# Altium schematic sheet Микроконтроллер.SchDoc
size 420 x 297 mm; Address1: Address1; Address2: Address2; Address3: Address3; Address4: Address4; DocumentNumber: АБВГ.123456.001 Э3; SheetNumber: 1; Scale: 1:1; DocumentType: Схема электрическая принципиальная; FirstReferrence: АБВГ.123456.001
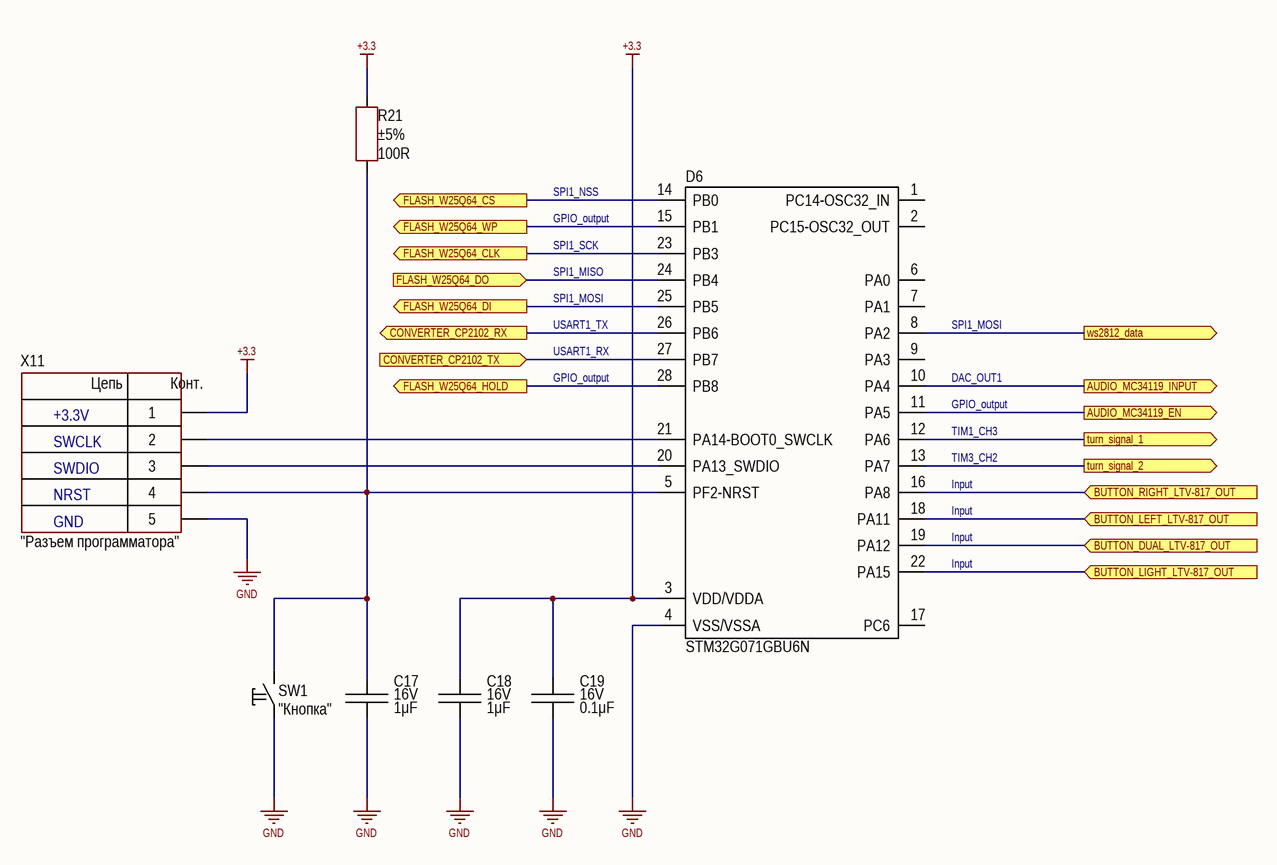
[diagram p0: Микроконтроллер.SchDoc]

## Parts
C17  value 1μF  Voltage: 16V  [CAP: 0603]
C18  value 1μF  Voltage: 16V  [CAP: 0603]
C19  value 0.1μF  Voltage: 16V  [CAP: 0603]
D6  (no value)  [28-UFQFPN]
R21  value 100R  Tolerance: ±5%  [RES: 0603]
SW1  CommentText: "Кнопка"  [BUT: 3x4x2 SMT]
X11  CommentText: "Разъем программатора"  [CON: PLS-5]

## Ports
AUDIO_MC34119_EN (out), AUDIO_MC34119_INPUT (out), BUTTON_DUAL_LTV-817_OUT (in), BUTTON_LEFT_LTV-817_OUT (in), BUTTON_LIGHT_LTV-817_OUT (in), BUTTON_RIGHT_LTV-817_OUT (in), CONVERTER_CP2102_RX (out), CONVERTER_CP2102_TX (in), FLASH_W25Q64_CLK (out), FLASH_W25Q64_CS (out), FLASH_W25Q64_DI (out), FLASH_W25Q64_DO (in), FLASH_W25Q64_HOLD (out), FLASH_W25Q64_WP (out), turn_signal_1 (out), turn_signal_2 (out), ws2812_data (out)

## Nets
+3.3: C18.2 C19.2 D6.3(VDD/VDDA) R21.2 X11.1
GND: C17.1 C18.1 C19.1 D6.4(VSS/VSSA) SW1.1 X11.5
AUDIO_MC34119_EN: D6.11(PA5) ; port AUDIO_MC34119_EN
AUDIO_MC34119_INPUT: D6.10(PA4) ; port AUDIO_MC34119_INPUT
BUTTON_DUAL_LTV-817_OUT: D6.19(PA12) ; port BUTTON_DUAL_LTV-817_OUT
BUTTON_LEFT_LTV-817_OUT: D6.18(PA11) ; port BUTTON_LEFT_LTV-817_OUT
BUTTON_LIGHT_LTV-817_OUT: D6.22(PA15) ; port BUTTON_LIGHT_LTV-817_OUT
BUTTON_RIGHT_LTV-817_OUT: D6.16(PA8) ; port BUTTON_RIGHT_LTV-817_OUT
CONVERTER_CP2102_RX: D6.26(PB6) ; port CONVERTER_CP2102_RX
CONVERTER_CP2102_TX: D6.27(PB7) ; port CONVERTER_CP2102_TX
FLASH_W25Q64_CLK: D6.23(PB3) ; port FLASH_W25Q64_CLK
FLASH_W25Q64_CS: D6.14(PB0) ; port FLASH_W25Q64_CS
FLASH_W25Q64_DI: D6.25(PB5) ; port FLASH_W25Q64_DI
FLASH_W25Q64_DO: D6.24(PB4) ; port FLASH_W25Q64_DO
FLASH_W25Q64_HOLD: D6.28(PB8) ; port FLASH_W25Q64_HOLD
FLASH_W25Q64_WP: D6.15(PB1) ; port FLASH_W25Q64_WP
turn_signal_1: D6.12(PA6) ; port turn_signal_1
turn_signal_2: D6.13(PA7) ; port turn_signal_2
ws2812_data: D6.8(PA2) ; port ws2812_data
NetC17_2: C17.2 D6.5(PF2-NRST) R21.1 SW1.2 X11.4
NetD6_20: D6.20(PA13_SWDIO) X11.3
NetD6_21: D6.21(PA14-BOOT0_SWCLK) X11.2

Not connected (* = marked no-connect by the designer): D6 1(PC14-OSC32_IN) 2(PC15-OSC32_OUT) 6(PA0) 7(PA1) 9(PA3) 17(PC6)

## Notes on the sheet
- SPI1_NSS
- GPIO_output
- SPI1_SCK
- SPI1_MISO
- SPI1_MOSI
- USART1_TX
- USART1_RX
- (near D6) DAC_OUT1
- (near D6) SPI1_MOSI
- +3.3V
- SWCLK
- (near D6) GPIO_output
- (near D6) TIM1_CH3
- SWDIO
- NRST
- (near D6) TIM3_CH2
- (near D6) Input
- GND
- Перв. примен.
- Справ. №
- Подп. и дата
- Инв. № дубл.
- Взам. инв. №
- Разраб.
- Изм.
- Лист
- № докум.
- Подп.
- Дата
- Лит.
- Масса
- Масштаб
- Пров.
- Т.контр.
- Листов
- Инв. № подл.
- Утв.
- Н.контр.
- 2.106-A3
- Копировал
- Формат А3
- (in symbol PLS-5) Цепь; Конт.

## Library data of the parts
C17 C18 = Ceramic_0603: Manufacturer: Yageo; PartNumber: CC0603KRX7R7BB104; ValueManufacturerPartNumber: Ceramic capacitor, 1μF, X7R, ±10%, 16V, 0603, -55...+125°C; TypeCapacitor: Ceramic capacitor; Tolerance: ±10%; TypeDielectric: X7R; Package: 0603; HelpURL: https://www.digikey.com/product-detail/en/yageo/CC0603KRX7R7BB104/311-1088-1-ND/302998; Temperature: -55...+125°C
C19 = Ceramic_0603: Manufacturer: Yageo; PartNumber: CC0603KRX7R7BB104; ValueManufacturerPartNumber: Ceramic capacitor, 0.1μF, X7R, ±10%, 16V, 0603, -55...+125°C; TypeCapacitor: Ceramic capacitor; Tolerance: ±10%; TypeDielectric: X7R; Package: 0603; HelpURL: https://www.digikey.com/product-detail/en/yageo/CC0603KRX7R7BB104/311-1088-1-ND/302998; Temperature: -55...+125°C
D6 = STM32G071GBU6N: Cortex-M0; Manufacturer: STMicroelectronics; ValueManufacturerPartNumber: IC microcontroller, 32-Bit, Cortex-M0, 64 MHz, 128KB, 32KB, 2.4...3.6V, -40...+85°C, QFN-28; Supply: 2.4...3.6V; Speed: 64 MHz; CoreSize: 32-Bit; MemoryROM: 128KB; MemoryRAM: 32KB; HelpURL: https://belchip.by/product/?selected_product=37987; Package: QFN-28; ComponentType: IC microcontroller; Temperature: -40...+85°C; CoreProcessor: Cortex-M0; PartNumber: STM32G071GBU6N
R21 = Resistor_0603: Manufacturer: Yageo; PartNumber: RC0603JR-07100RL; ValueManufacturerPartNumber: Resistor film, 100R, ±5%, 0603, 0.1W, -55...+125°C; TypeResistor: Resistor film; Power: 0.1W; Package: 0603; HelpURL: https://www.digikey.com/product-detail/en/yageo/RC0603JR-07100RL/311-100GRCT-ND/729644; Temperature: -55...+125°C
SW1 = Button_3x4x2_SMT: SMT 3*4*2 2PIN; Manufacturer: xin cheng electronic; HelpURL: https://aliexpress.ru/item/32309509976.html?spm=a2g0v.12010612.8148356.51.441f61b1yUlL0Q; ValueManufacturerPartNumber: =TypeButton+', '+Package; PartNumber: 3*4*2 2PIN; Package: 3*4*2mm
X11 = PLS-5: Manufacturer: Connfly; ValueManufacturerPartNumber: Connector, 5pin, 2.54mm, 500VAC, 3A; TypeConnector: Connector; VoltageMax: 500VAC; Pitch: 2.54mm; CurrentMax: 3A; Multichannel: 5pin; HelpURL: https://www.chipdip.ru/product/pls-5; PartNumber: PLS-5